# Altium schematic sheet codesanner.SchDoc
size A2
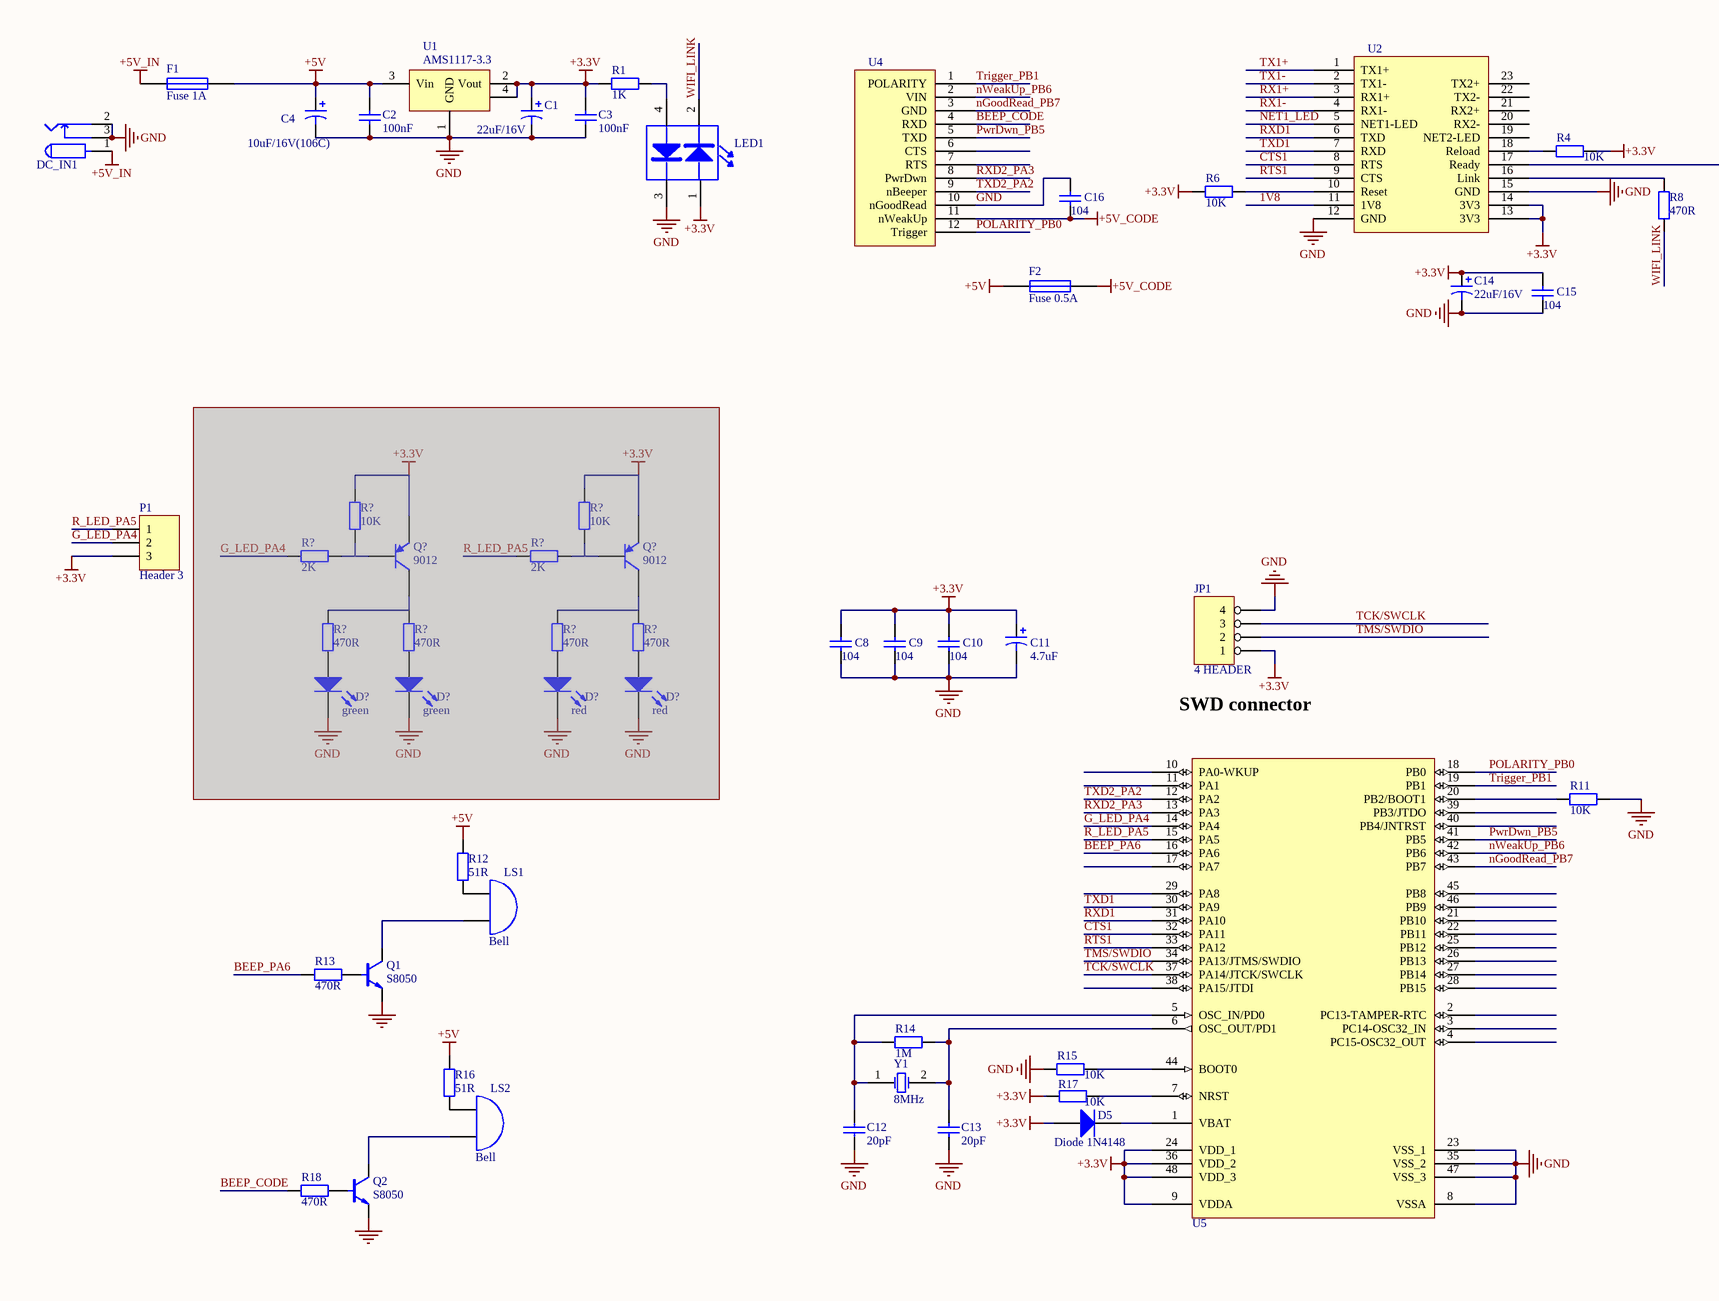
[diagram p0: codesanner.SchDoc, left]
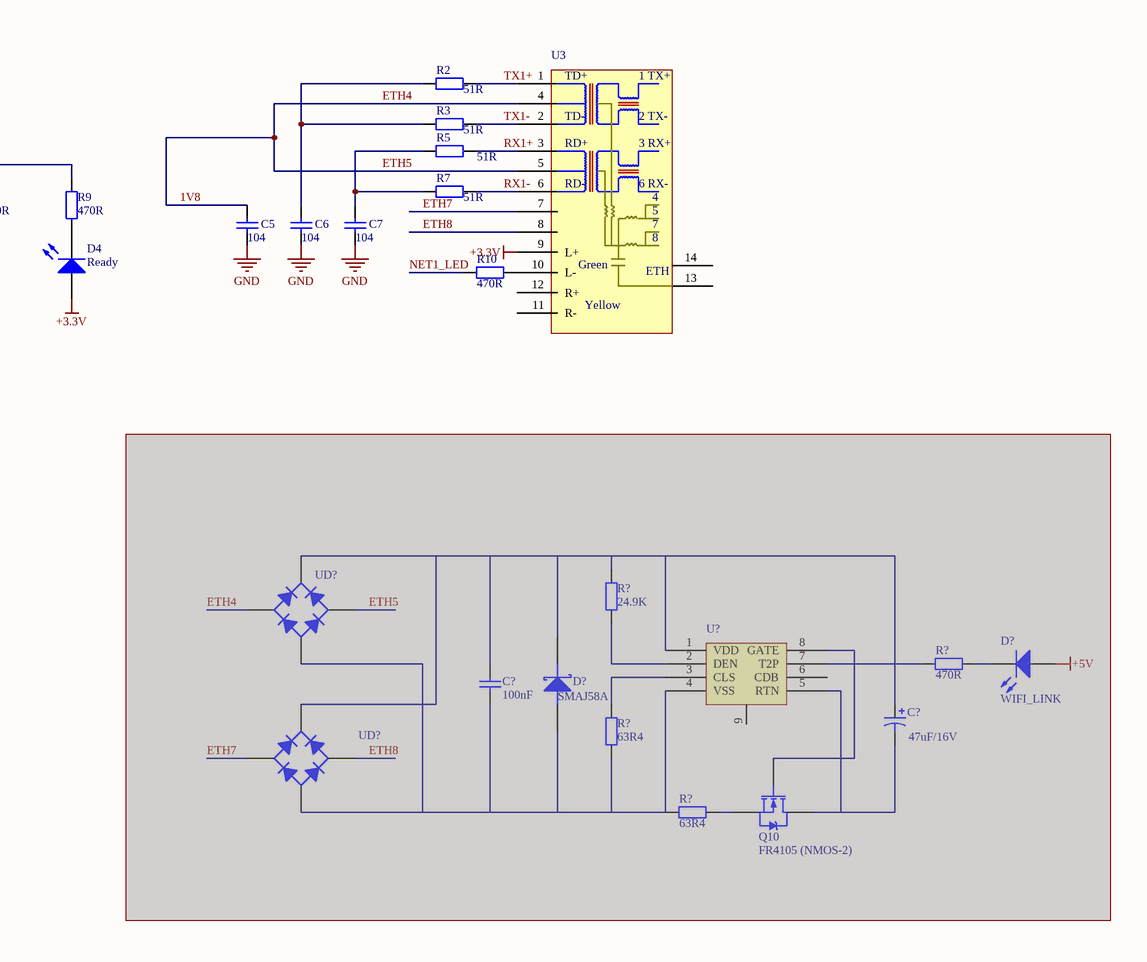
[diagram p1: codesanner.SchDoc, right]

## Parts
(Parts that share a designator on the sheet are numbered #1, #2 ... from top to bottom, then left to right.)
C1  value 22uF/16V  [B: 3528]  (hidden comment: Cap Pol3)
C2  value 100nF  [0805]  (hidden comment: Cap)
C3  value 100nF  [0805]  (hidden comment: Cap)
C4  value 10uF/16V(106C)  [CAP A-3216]  (hidden comment: Cap Pol3)
C5  value 104  [C0805tan]  (hidden comment: Cap)
C6  value 104  [C0805tan]  (hidden comment: Cap)
C7  value 104  [C0805tan]  (hidden comment: Cap)
C8  value 104  [C0805tan]  (hidden comment: Cap)
C9  value 104  [C0805tan]  (hidden comment: Cap)
C10  value 104  [C0805tan]  (hidden comment: Cap)
C11  value 4.7uF  [3225[1210]]  (hidden comment: Cap Pol1)
C12  value 20pF  [C0805tan]  (hidden comment: Cap)
C13  value 20pF  [C0805tan]  (hidden comment: Cap)
C14  value 22uF/16V  [B: 3528]  (hidden comment: Cap Pol3)
C15  value 104  [C0805tan]  (hidden comment: Cap)
C16  value 104  [C0805tan]  (hidden comment: Cap)
C?#1  value 100nF  [0805]  (hidden comment: Cap)  (masked out: inside a compile mask, not in the netlist)
C?#2  value 47uF/16V  [B: 3528]  (hidden comment: Cap Pol3)  (masked out: inside a compile mask, not in the netlist)
D4  Ready  [LED-0805]
D5  Diode 1N4148  [LL34]
D?#1  green  [LED-0805]  (masked out: inside a compile mask, not in the netlist)
D?#2  green  [LED-0805]  (masked out: inside a compile mask, not in the netlist)
D?#3  red  [LED-0805]  (masked out: inside a compile mask, not in the netlist)
D?#4  red  [LED-0805]  (masked out: inside a compile mask, not in the netlist)
D?#5  WIFI_LINK  [LED-0805]  (masked out: inside a compile mask, not in the netlist)
D?#6  Diode  [SMC]  (value not drawn)  (masked out: inside a compile mask, not in the netlist)
DC_IN1  POW  [DC10B]  (value not drawn)
F1  Fuse 1A  [3225[1210]]
F2  Fuse 0.5A  [C0805TAN]
JP1  4 HEADER  [CON4_1.5]
LED1  LED_double_DIP  [LED_double]  (value not drawn)
LS1  Bell  [Bell]
LS2  Bell  [Bell]
P1  Header 3  [CON3_1.5]
Q1  S8050  [SOT-23]
Q2  S8050  [SOT-23]
Q10  FR4105 (NMOS-2)  [TO-252]  (masked out: inside a compile mask, not in the netlist)
Q?#1  9012  [SOT-23B]  (masked out: inside a compile mask, not in the netlist)
Q?#2  9012  [SOT-23B]  (masked out: inside a compile mask, not in the netlist)
R1  value 1K  [C0805TAN]  (hidden comment: Res2)
R2  value 51R  [C0805TAN]  (hidden comment: Res2)
R3  value 51R  [C0805TAN]  (hidden comment: Res2)
R4  value 10K  [C0805TAN]  (hidden comment: Res2)
R5  value 51R  [C0805TAN]  (hidden comment: Res2)
R6  value 10K  [C0805TAN]  (hidden comment: Res2)
R7  value 51R  [C0805TAN]  (hidden comment: Res2)
R8  value 470R  [C0805TAN]  (hidden comment: Res2)
R9  value 470R  [C0805TAN]  (hidden comment: Res2)
R10  value 470R  [C0805TAN]  (hidden comment: Res2)
R11  value 10K  [C0805tan]  (hidden comment: Res2)
R12  value 51R  [C0805TAN]  (hidden comment: Res2)
R13  value 470R  [C0805TAN]  (hidden comment: Res2)
R14  value 1M  [C0805tan]  (hidden comment: Res2)
R15  value 10K  [C0805tan]  (hidden comment: Res2)
R16  value 51R  [C0805TAN]  (hidden comment: Res2)
R17  value 10K  [C0805tan]  (hidden comment: Res2)
R18  value 470R  [C0805TAN]  (hidden comment: Res2)
R?#1  value 10K  [C0805TAN]  (hidden comment: Res2)  (masked out: inside a compile mask, not in the netlist)
R?#2  value 10K  [C0805TAN]  (hidden comment: Res2)  (masked out: inside a compile mask, not in the netlist)
R?#3  value 2K  [C0805TAN]  (hidden comment: Res2)  (masked out: inside a compile mask, not in the netlist)
R?#4  value 2K  [C0805TAN]  (hidden comment: Res2)  (masked out: inside a compile mask, not in the netlist)
R?#5  value 24.9K  [C0805TAN]  (hidden comment: Res2)  (masked out: inside a compile mask, not in the netlist)
R?#6  value 470R  [C0805TAN]  (hidden comment: Res2)  (masked out: inside a compile mask, not in the netlist)
R?#7  value 470R  [C0805TAN]  (hidden comment: Res2)  (masked out: inside a compile mask, not in the netlist)
R?#8  value 470R  [C0805TAN]  (hidden comment: Res2)  (masked out: inside a compile mask, not in the netlist)
R?#9  value 470R  [C0805TAN]  (hidden comment: Res2)  (masked out: inside a compile mask, not in the netlist)
R?#10  value 470R  [C0805TAN]  (hidden comment: Res2)  (masked out: inside a compile mask, not in the netlist)
R?#11  value 63R4  [C0805TAN]  (hidden comment: Res2)  (masked out: inside a compile mask, not in the netlist)
R?#12  value 63R4  [C0805TAN]  (hidden comment: Res2)  (masked out: inside a compile mask, not in the netlist)
U1  AMS1117-3.3  [SOT223]
U2  USR-WIFI232-D2  [USR-WIFI232-D2]  (value not drawn)
U3  HR911105A  [HR911105A]  (value not drawn)
U4  CR8000_12PIN  [CR8000_12PIN]  (value not drawn)
U5  STM32F103C8T6  [LQFP48]  (value not drawn)
U?  TPS2379  [SO8_PAD]  (value not drawn)  (masked out: inside a compile mask, not in the netlist)
UD?#1  MB6S  [MB6S]  (value not drawn)  (masked out: inside a compile mask, not in the netlist)
UD?#2  MB6S  [MB6S]  (value not drawn)  (masked out: inside a compile mask, not in the netlist)
Y1  8MHz  [XTAL_US]

## Nets
+3.3V: C1.1 C3.2 C8.2 C9.2 C10.2 C11.1 C14.1 C15.2 D4.1(A) D5.1(A) JP1.1 LED1.1 P1.3 R1.2 R4.2 R6.1 R17.1 U1.2(Vout) U1.4 U2.13(3V3) U2.14(3V3) U3.9(L+) U5.9(VDDA) U5.24(VDD_1) U5.36(VDD_2) U5.48(VDD_3)
+5V: C2.2 C4.1 F1.2 F2.1 R12.1 R16.1 U1.3(Vin)
+5V_CODE: C16.1 F2.2 U4.11(nWeakUp)
+5V_IN: DC_IN1.1 F1.1
GND: C1.2 C2.1 C3.1 C4.2 C5.1 C6.1 C7.1 C8.1 C9.1 C10.1 C11.2 C12.1 C13.1 C14.2 C15.1 C16.2 DC_IN1.2 DC_IN1.3 JP1.4 LED1.3 Q1.2(E) Q2.2(E) R11.2 R15.1 U1.1(GND) U2.12(GND) U2.15(GND) U4.10(nGoodRead) U5.8(VSSA) U5.23(VSS_1) U5.35(VSS_2) U5.47(VSS_3)
1V8: C5.2 U2.11(1V8) U3.4 U3.5  [also labelled ETH4, ETH5]
BEEP_CODE: R18.2 U4.4(RXD)
BEEP_PA6: R13.2 U5.16(PA6)
CTS1: U2.8(RTS) U5.32(PA11)
ETH7: U3.7
ETH8: U3.8
G_LED_PA4: P1.2 U5.14(PA4)
NET1_LED: R10.1 U2.5(NET1-LED)
nGoodRead_PB7: U4.3(GND) U5.43(PB7)
nWeakUp_PB6: U4.2(VIN) U5.42(PB6)
POLARITY_PB0: U4.12(Trigger) U5.18(PB0)
PwrDwn_PB5: U4.5(TXD) U5.41(PB5)
R_LED_PA5: P1.1 U5.15(PA5)
RTS1: U2.9(CTS) U5.33(PA12)
RX1+: R5.2 U2.3(RX1+) U3.3
RX1-: R7.2 U2.4(RX1-) U3.6
RXD1: U2.6(TXD) U5.31(PA10)
RXD2_PA3: U4.8(PwrDwn) U5.13(PA3)
TCK/SWCLK: JP1.3 U5.37(PA14/JTCK/SWCLK)
TMS/SWDIO: JP1.2 U5.34(PA13/JTMS/SWDIO)
Trigger_PB1: U4.1(POLARITY) U5.19(PB1)
TX1+: R2.2 U2.1(TX1+) U3.1
TX1-: R3.2 U2.2(TX1-) U3.2
TXD1: U2.7(RXD) U5.30(PA9)
TXD2_PA2: U4.9(nBeeper) U5.12(PA2)
WIFI_LINK: LED1.2 R8.2
NetC6_2: C6.2 R2.1 R3.1
NetC7_2: C7.2 R5.1 R7.1
NetC12_2: C12.2 R14.1 U5.5(OSC_IN/PD0) Y1.1(OSC1)
NetC13_2: C13.2 R14.2 U5.6(OSC_OUT/PD1) Y1.2(OSC2)
NetD4_2: D4.2(K) R9.2
NetD5_2: D5.2(K) U5.1(VBAT)
NetLED1_4: LED1.4 R1.1
NetLS1_1: LS1.1(A) R12.2
NetLS1_2: LS1.2(B) Q1.3(C)
NetLS2_1: LS2.1(A) R16.2
NetLS2_2: LS2.2(B) Q2.3(C)
NetQ1_1: Q1.1(B) R13.1
NetQ2_1: Q2.1(B) R18.1
NetR4_1: R4.1 U2.18(Reload)
NetR6_2: R6.2 U2.10(Reset)
NetR8_1: R8.1 U2.16(Link)
NetR9_1: R9.1 U2.17(Ready)
NetR10_2: R10.2 U3.10(L-)
NetR11_1: R11.1 U5.20(PB2/BOOT1)
NetR15_2: R15.2 U5.44(BOOT0)
NetR17_2: R17.2 U5.7(NRST)

Not connected (* = marked no-connect by the designer): U2 19(NET2-LED) 20(RX2-) 21(RX2+) 22(TX2-) 23(TX2+); U3 11(R-) 12(R+) 13 14; U4 6(CTS) 7(RTS); U5 2(PC13-TAMPER-RTC) 3(PC14-OSC32_IN) 4(PC15-OSC32_OUT) 10(PA0-WKUP) 11(PA1) 17(PA7) 21(PB10) 22(PB11) 25(PB12) 26(PB13) 27(PB14) 28(PB15) 29(PA8) 38(PA15/JTDI) 39(PB3/JTDO) 40(PB4/JNTRST) 45(PB8) 46(PB9)

## Notes on the sheet
- SWD connector
- (in symbol Diode) SMAJ58A
- (in symbol HR911105A) TD+; 1 TX+; TD-; 2 TX-; RD+; 3 RX+; RD-; 6 RX-; Green; ETH; Yellow

## Library data of the parts
C1 C4 C14 C?#2 = Cap Pol3: Polarized Capacitor (Surface Mount); Published: 8-Jun-2000; LatestRevisionDate: 17-Jul-2002; LatestRevisionNote: Re-released for DXP Platform.; PackageReference: C0805; Publisher: Altium Limited
C2 C3 C5-C10 C12 C13 C15 C16 C?#1 = Cap: Capacitor; Published: 8-Jun-2000; LatestRevisionDate: 17-Jul-2002; LatestRevisionNote: Re-released for DXP Platform.; Publisher: Altium Limited
  C2 C3 C5-C10 C15 C16 C?#1: PackageReference: RAD-0.3
C11 = Cap Pol1: Polarized Capacitor (Radial); Published: 8-Jun-2000; LatestRevisionDate: 17-Jul-2002; LatestRevisionNote: Re-released for DXP Platform.; PackageReference: RB7.6-15; Publisher: Altium Limited
D4 D?#1-D?#5 = LED2: Typical RED, GREEN, YELLOW, AMBER GaAs LED; Published: 8-Jun-2000; LatestRevisionDate: 17-Jul-2002; LatestRevisionNote: Re-released for DXP Platform.; PackageDocument: Feb-2002; PackageReference: 3.2X1.6X1.1; Publisher: Altium Limited
D5 = Diode 1N4148: High Conductance Fast Diode; Published: 8-Jun-2000; LatestRevisionDate: 17-Jul-2002; LatestRevisionNote: Re-released for DXP Platform.; DatasheetDocument: 1997; PackageReference: DO-35; Publisher: Altium Limited; Code_JEDEC: DO-204-AH; ComponentLink1Description: Manufacturer Link; ComponentLink1URL: http://www.fairchildsemi.com/; ComponentLink2Description: Datasheet; ComponentLink2URL: http://www.fairchildsemi.com/ds/1N%2F1N4148.pdf
F1 F2 = Fuse 1: Fuse; Published: 8-Jun-2000; LatestRevisionDate: 17-Jul-2002; LatestRevisionNote: Re-released for DXP Platform.; PackageReference: PIN-W2/E2.8; Publisher: Altium Limited
JP1 = 4 HEADER: 4 Pin Header
LS1 LS2 = Bell: Electrical Bell; Published: 24-Mar-1999; LatestRevisionDate: 17-Jul-2002; LatestRevisionNote: Re-released for DXP Platform.; PackageReference: PIN2; Publisher: Altium Limited
P1 = Header 3: Header, 3-Pin; LatestRevisionDate: 17-Jul-2002; LatestRevisionNote: Re-released for DXP Platform.; Publisher: Altium Limited
Q1 Q2 = MMBT3904
Q10 = NMOS-2: N-Channel Power MOSFET; Note: Pin 2 is electrically connected to pin 4.; Published: 8-Jun-2000; LatestRevisionDate: 17-Jul-2002; LatestRevisionNote: Re-released for DXP Platform.; DatasheetDocument: PD-9.814; PackageReference: TO-220AB; Publisher: Altium Limited; Code_JEDEC: TO-220-AB; ComponentLink1Description: Manufacturer Link; ComponentLink1URL: http://www.irf.com/
Q?#1 Q?#2 = PNP: PNP Bipolar Transistor; Published: 8-Jun-2000; LatestRevisionDate: 17-Jul-2002; LatestRevisionNote: Re-released for DXP Platform.; PackageReference: SOT-23B; Publisher: Altium Limited; Code_JEDEC: SOT-23
R1-R18 R?#1-R?#12 = Res2: Resistor; Published: 8-Jun-2000; LatestRevisionDate: 17-Jul-2002; LatestRevisionNote: Re-released for DXP Platform.; Publisher: Altium Limited
  R1-R10 R12 R13 R16 R18 R?#1-R?#12: PackageReference: AXIAL-0.4
U1 = AMS1117-5
Y1 = XTAL: Crystal Oscillator; Published: 8-Jun-2000; LatestRevisionDate: 17-Jul-2002; LatestRevisionNote: Re-released for DXP Platform.; Publisher: Altium Limited